# Altium project DS153-1.0-C氢气传感器.PrjPcb
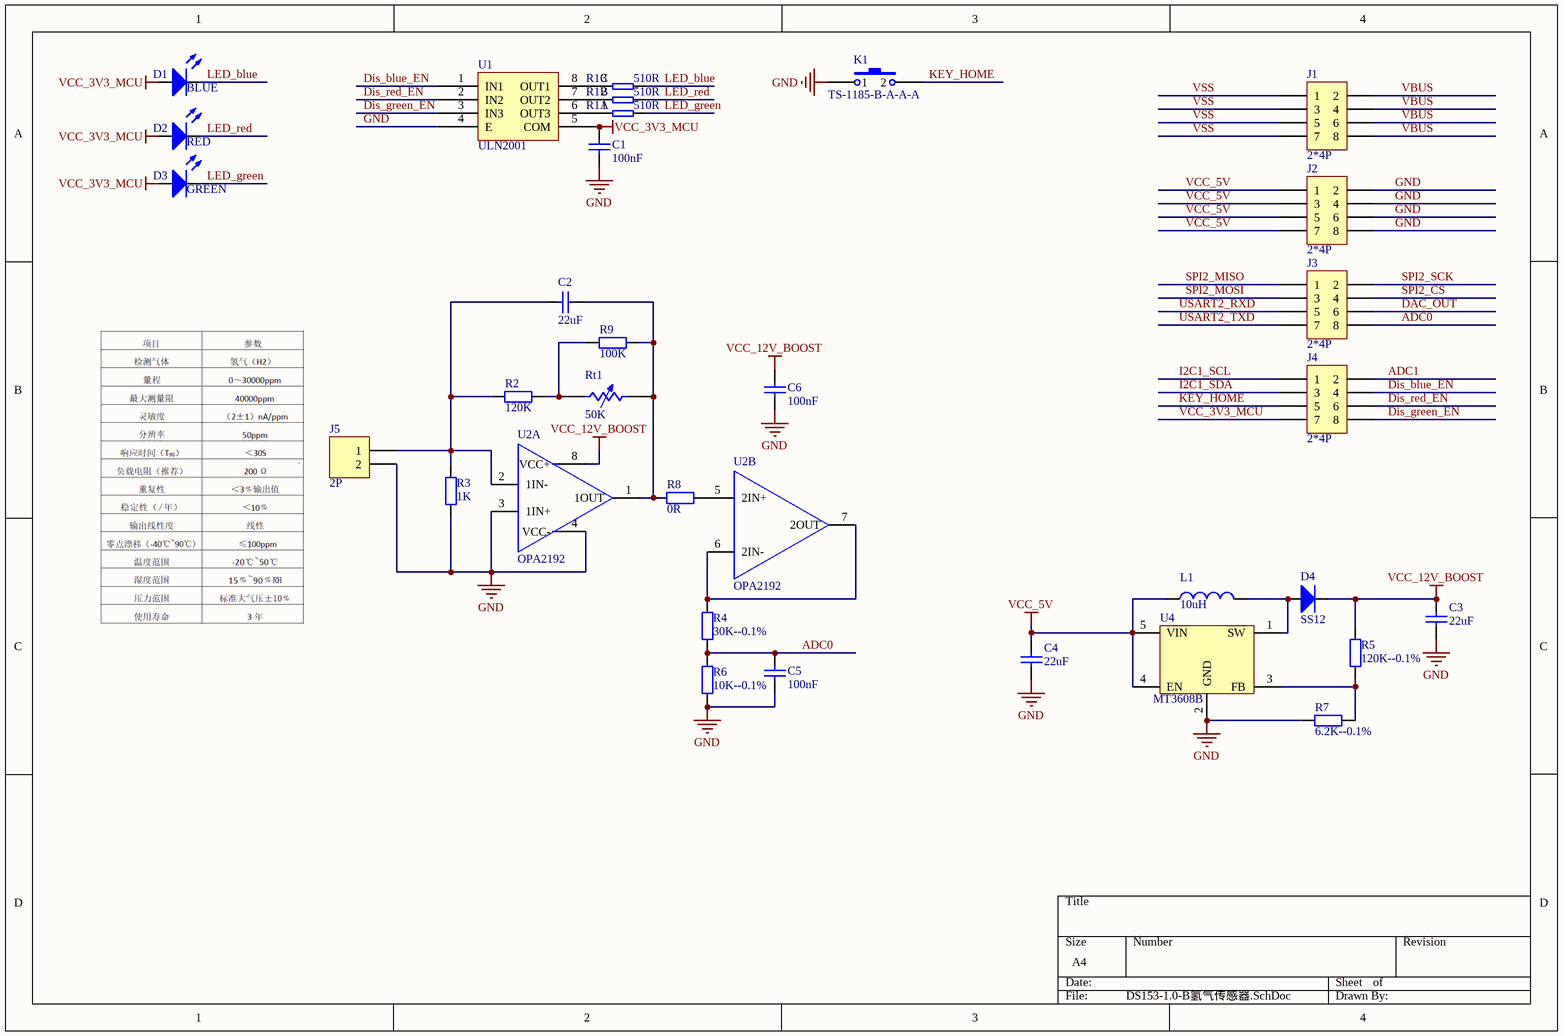
[diagram p0: DS153-1.0-B氢气传感器.SchDoc]
1 sheet, 30 parts. Net scope: global (net labels, ports and power ports of the same name join across sheets).
Board files: DS153-1.0-B氢气传感器.PcbDoc, DS153-1.0-C氢气传感器.PcbDoc

## Sheet DS153-1.0-B氢气传感器.SchDoc
size A4; SheetNumber: 1; SheetTotal: 1

### Parts
C1  value 100nF  [0603CAP]  (hidden comment: SMDCAP00013)
C2  value 22uF  [1206CAP]  (hidden comment: MLCC 22uF 50V ±20％ 1206)
C3  value 22uF  [1206CAP]  (hidden comment: MLCC 22uF 50V ±20％ 1206)
C4  value 22uF  [1206CAP]  (hidden comment: MLCC 22uF 50V ±20％ 1206)
C5  value 100nF  [0603CAP]  (hidden comment: SMDCAP00013)
C6  value 100nF  [0603CAP]  (hidden comment: SMDCAP00013)
D1  value BLUE  [LED_0805]  (hidden comment: SMDLED00010)
D2  value RED  [LED_0805]  (hidden comment: SMDLED00003)
D3  value GREEN  [LED_0805]  (hidden comment: Chip 翠绿LED 0805)
D4  value SS12  [SMA/DO-214AC]  (hidden comment: SMDDIODE06003)
J1  value 2*4P  [X1321WVS-2x04J-C40D53]  (hidden comment: X1321WVS-2x04J-C40D53)
J2  value 2*4P  [X1321WVS-2x04J-C40D53]  (hidden comment: X1321WVS-2x04J-C40D53)
J3  value 2*4P  [X1321WVS-2x04J-C40D53]  (hidden comment: X1321WVS-2x04J-C40D53)
J4  value 2*4P  [X1321WVS-2x04J-C40D53]  (hidden comment: X1321WVS-2x04J-C40D53)
J5  value 2P  [SIP2]  (hidden comment: SL000000042)
K1  TS-1185-B-A-A-A  [KEY_TS-1185-x-A-A-A]
L1  小型化一体成型T-CORE,SMD,2x2.5mm  [SMD,2x2.5mm]  (value not drawn)
R1  value 510R  [0603RES_Pack4]  (hidden comment: SMDRES05003)  (parts A,B,C of 4)
R2  value 120K  [0603RES]  (hidden comment: Chip 120K 1/16W ±1％ 0603)
R3  value 1K  [0603RES]  (hidden comment: SMDRES00034)
R4  value 30K--0.1%  [0603RES]  (hidden comment: SMDRES00060)
R5  value 120K--0.1%  [0603RES]  (hidden comment: Chip 120K 1/16W ±1％ 0603)
R6  value 10K--0.1%  [0603RES]  (hidden comment: SMDRES00056)
R7  value 6.2K--0.1%  [0603RES]  (hidden comment: SMDRES00056)
R8  value 0R  [0603RES]  (hidden comment: Chip 0R 1/16W ±1％ 0603)
R9  value 100K  [0603RES]  (hidden comment: SMDRES00071)
Rt1  value 50K  [DIP_CAP_2.54mm]  (hidden comment: SE000000015)
U1  value ULN2001  [SO-8]  (hidden comment: SMDIC000018)
U2  OPA2192  [SO-8]  (parts A,B of 2)
U4  MT3608B  [SOT23-6]

### Nets
GND: C1.1 C3.2 C4.2 C5.1 C6.1 J2.2 J2.4 J2.6 J2.8 J5.2 K1.1 R3.1 R6.1 R7.1 U1.4(E) U2.3(1IN+) U2.4(VCC-) U4.2(GND)
VCC_3V3_MCU: C1.2 D1.1(A) D2.1(A) D3.1(A) J4.7 U1.5(COM)
VCC_5V: C4.1 J2.1 J2.3 J2.5 J2.7 L1.1 U4.4(EN) U4.5(VIN)
VCC_12V_BOOST: C3.1 C6.2 D4.2(K) R5.2 U2.8(VCC+)
ADC0: C5.2 J3.8 R4.1 R6.2
ADC1: J4.2
DAC_OUT: J3.6
Dis_blue_EN: J4.4 U1.1(IN1)
Dis_green_EN: J4.8 U1.3(IN3)
Dis_red_EN: J4.6 U1.2(IN2)
I2C1_SCL: J4.1
I2C1_SDA: J4.3
KEY_HOME: J4.5 K1.2
LED_blue: D1.2(K) R1.6
LED_green: D3.2(K) R1.8
LED_red: D2.2(K) R1.7
SPI2_CS: J3.4
SPI2_MISO: J3.1
SPI2_MOSI: J3.3
SPI2_SCK: J3.2
USART2_RXD: J3.5
USART2_TXD: J3.7
VBUS: J1.2 J1.4 J1.6 J1.8
VSS: J1.1 J1.3 J1.5 J1.7
NetC2_1: C2.1 J5.1 R2.1 R3.2 U2.2(1IN-)
NetC2_2: C2.2 R8.1 R9.2 Rt1.1 U2.1(1OUT)
NetD4_1: D4.1(A) L1.2 U4.1(SW)
NetR1_1: R1.1 U1.6(OUT3)
NetR1_2: R1.2 U1.7(OUT2)
NetR1_3: R1.3 U1.8(OUT1)
NetR2_2: R2.2 R9.1 Rt1.2
NetR4_2: R4.2 U2.6(2IN-) U2.7(2OUT)
NetR5_1: R5.1 R7.2 U4.3(FB)
NetR8_2: R8.2 U2.5(2IN+)

Not connected (* = marked no-connect by the designer): U4 6(NC)

### Notes on the sheet
- (in symbol FTC252012S100MBCA) 10uH

### Library data of the parts
C1 C5 C6 = MLCC 100nF 50V ±10％ 0603: 贴片电容
C2-C4 = MLCC 22uF 50V ±20％ 1206: 贴片电容
D1 = Chip 蓝色LED 0805: 贴片LED
D2 = Chip 红色LED 0805: 贴片LED
D3 = Chip 翠绿LED 0805: 贴片LED
D4 = SS12 SMA/DO-214AC（1N5817）: 贴片肖特基二极管
J1-J4 = X1321WVS-2x04J-C40D53: 双排针2x4P 立贴 1.27mm
J5 = DIP2 单排直针 1*40P 间距2.54mm 针长11mm 铜: 单排直针
K1 = TS-1185-B-A-A-A: 轻触开关; Value: TS-1185-B-A-A-A
L1 = FTC252012S100MBCA: 电感值 10uH ±20% / 饱和电流(Isat) 1.6A / 额定电流 1.2A / 直流电阻(DCR) 330mΩ
R1 = Chip R*4 510R 1/16W ±5％ 0603: 贴片排阻
R2 R5 = Chip 120K 1/16W ±1％ 0603: 贴片电阻
R3 = Chip 1K 1/16W ±1％ 0603: 贴片电阻
R4 = Chip 30K 1/16W ±1％ 0603: 贴片电阻
R6 R7 = Chip 10K 1/16W ±1％ 0603: 贴片电阻
R8 = Chip 0R 1/16W ±1％ 0603: 贴片电阻
R9 = Chip 100K 1/16W ±1％ 0603: 贴片电阻
Rt1 = NTC 10K 热敏电阻 5% Φ5 MF52A1 B值:3950K: 热敏电阻
U1 = ULN2001 SOP-8: 电机驱动芯片
U2 = TL062C
U4 = MT3608B: MT3608B 是一款高效的1.2MHz固定频率电流模式升压转换器。